# Altium schematic sheet LCDTFT_CTRL_FT811.SchDoc
size A3
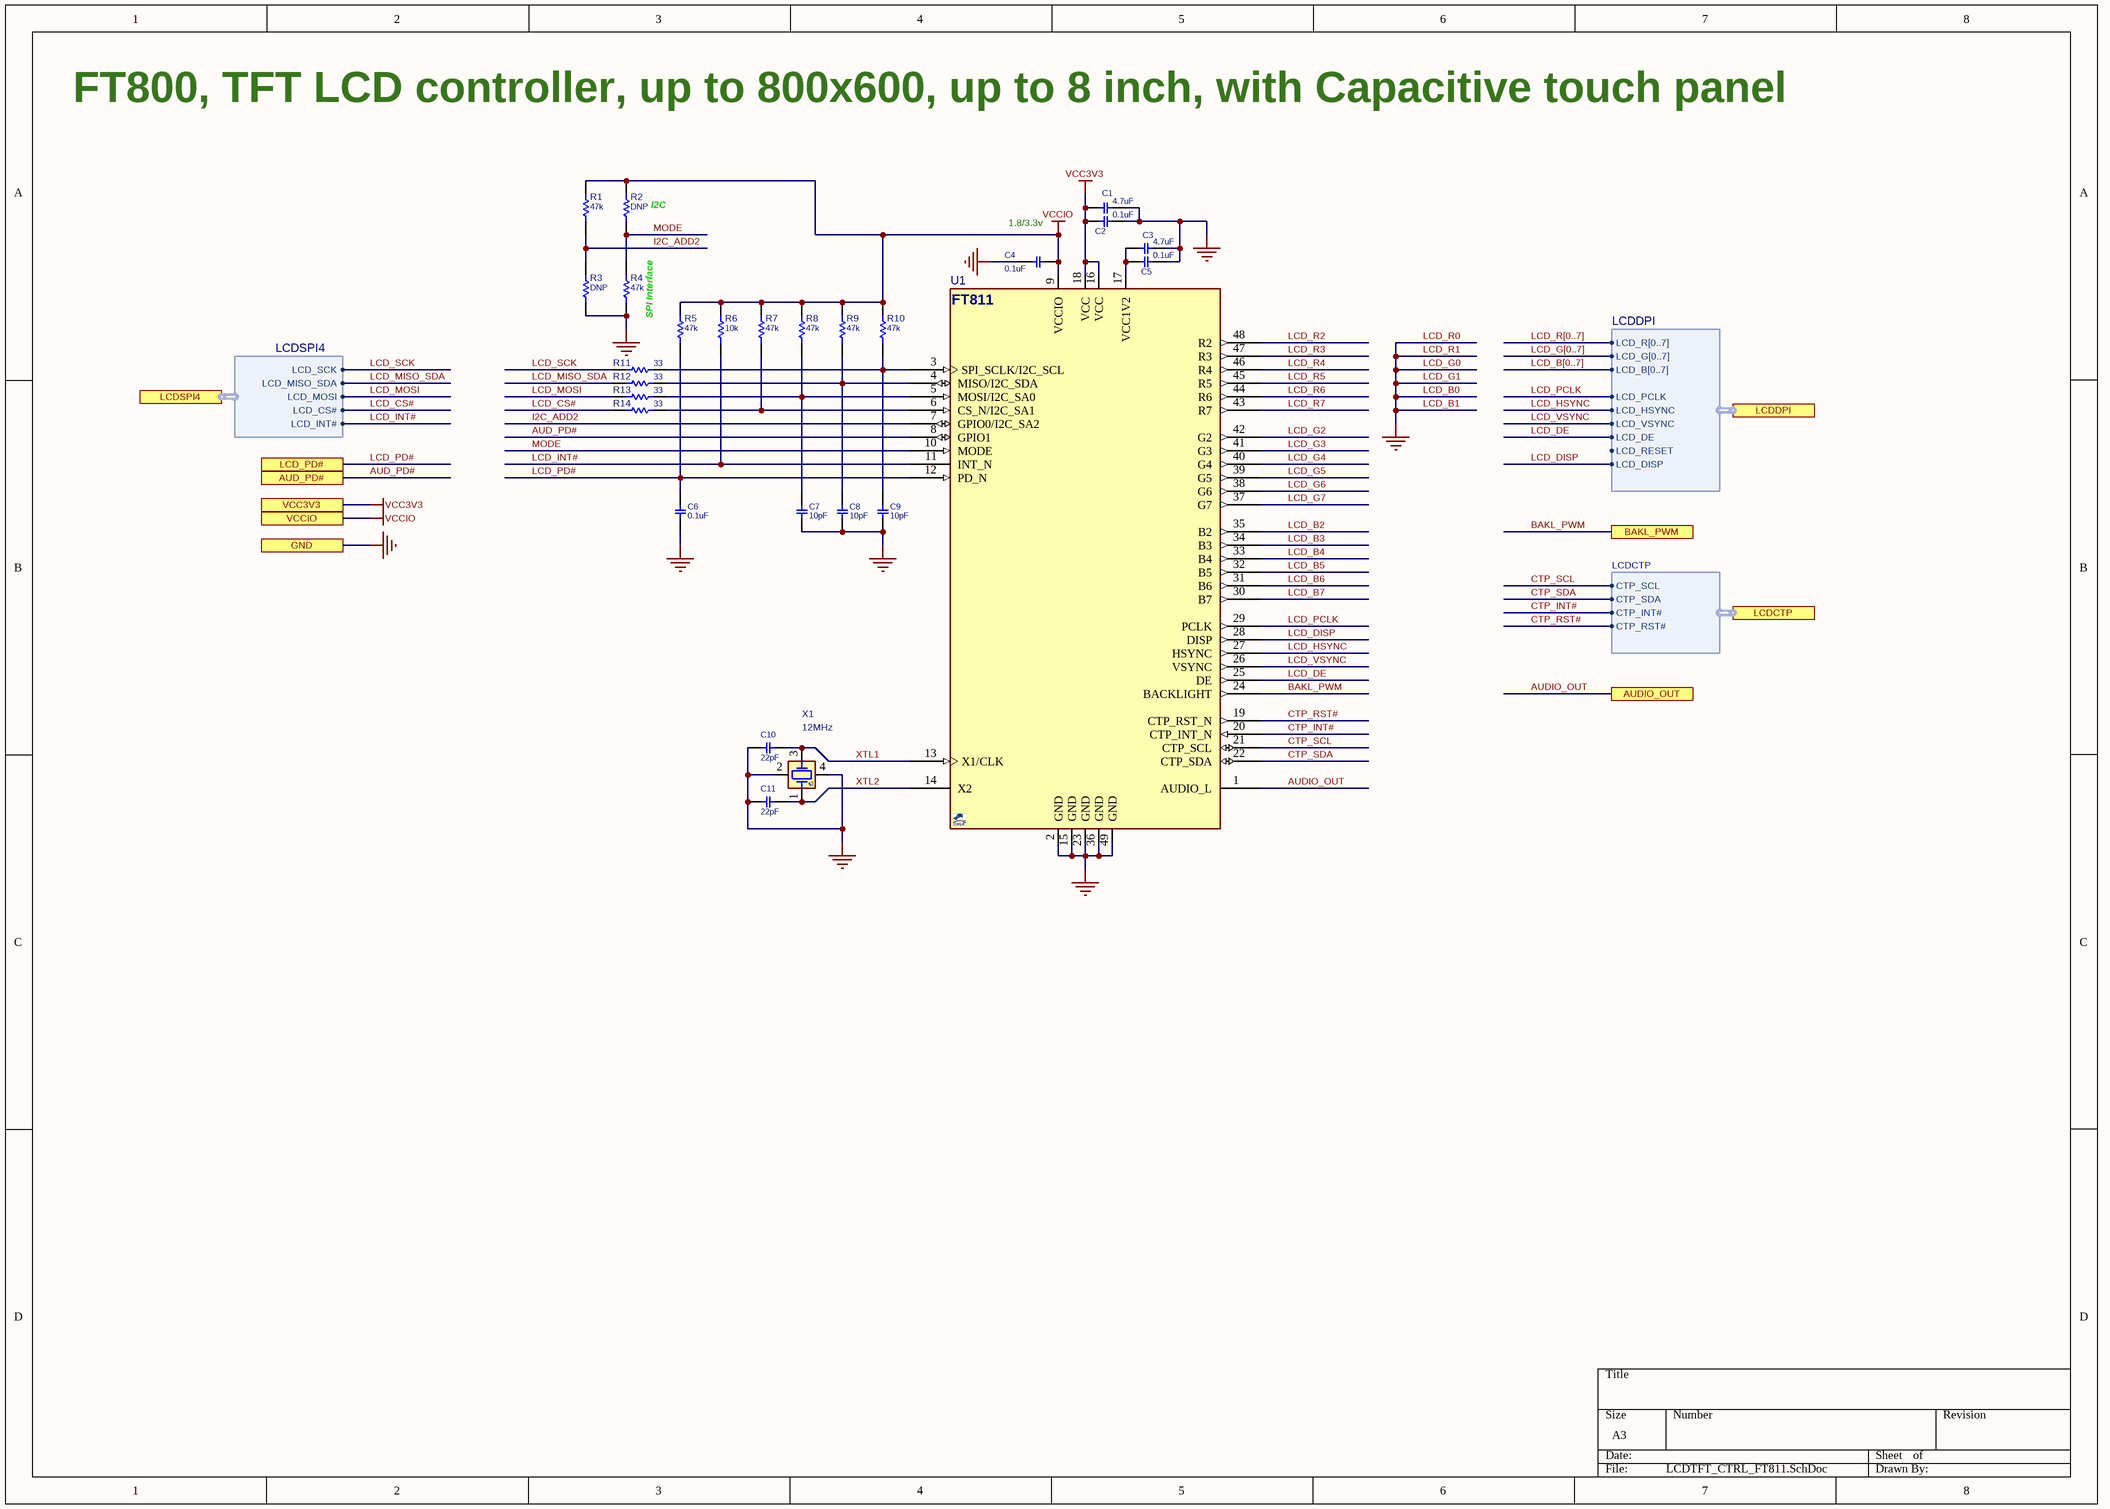
[diagram p0: LCDTFT_CTRL_FT811.SchDoc]

## Parts
C1  4.7uF  [C0603]
C2  0.1uF  [C0402]
C3  4.7uF  [C0603]
C4  0.1uF  [C0402]
C5  0.1uF  [C0402]
C6  0.1uF  [C0402]
C7  10pF  [C0402]
C8  10pF  [C0402]
C9  10pF  [C0402]
C10  22pF  [C0402]
C11  22pF  [C0402]
R1  47k  [R0402]
R2  DNP  [R0402]
R3  DNP  [R0402]
R4  47k  [R0402]
R5  47k  [R0402]
R6  10k  [R0402]
R7  47k  [R0402]
R8  47k  [R0402]
R9  47k  [R0402]
R10  47k  [R0402]
R11  33  [R0402]
R12  33  [R0402]
R13  33  [R0402]
R14  33  [R0402]
U1  FT811  [QFN50_48T]  (value not drawn)
X1  12MHz  [XTL_4_3225]

## Ports
AUD_PD#, AUDIO_OUT, BAKL_PWM, GND, LCD_PD#, LCDCTP (harness LCDCTP), LCDDPI (harness LCDDPI), LCDSPI4 (harness LCDSPI4), VCC3V3, VCCIO

## Harnesses
LCDDPI: LCD_PCLK, LCD_HSYNC, LCD_VSYNC, LCD_DE, LCD_R[0..7], LCD_G[0..7], LCD_B[0..7], LCD_RESET, LCD_DISP
LCDSPI4: LCD_SCK, LCD_MISO_SDA, LCD_MOSI, LCD_CS#, LCD_INT#
LCDCTP: CTP_SCL, CTP_SDA, CTP_INT#, CTP_RST#

## Nets
LCD_B0: C1.1 C2.1 C3.1 C4.2 C5.1 C6.2 C7.2 C8.2 C9.2 C10.1 C11.2 R3.2 R4.2 U1.2(GND) U1.15(GND) U1.23(GND) U1.36(GND) U1.49(GND) X1.2 X1.4 ; port GND  [also labelled GND, LCD_B1, LCD_G0, LCD_G1, LCD_R0, LCD_R1]
VCC3V3: C1.2 C2.2 U1.16(VCC) U1.18(VCC) ; port VCC3V3
VCCIO: C4.1 R1.1 R2.1 R5.1 R6.1 R7.1 R8.1 R9.1 R10.1 U1.9(VCCIO) ; port VCCIO
AUD_PD#: U1.8(GPIO1) ; port AUD_PD#
AUDIO_OUT: U1.1(AUDIO_L) ; port AUDIO_OUT
BAKL_PWM: U1.24(BACKLIGHT) ; port BAKL_PWM
CTP_INT#: U1.20(CTP_INT_N) ; port LCDCTP.CTP_INT#
CTP_RST#: U1.19(CTP_RST_N) ; port LCDCTP.CTP_RST#
CTP_SCL: U1.21(CTP_SCL) ; port LCDCTP.CTP_SCL
CTP_SDA: U1.22(CTP_SDA) ; port LCDCTP.CTP_SDA
I2C_ADD2: R1.2 R3.1 U1.7(GPIO0/I2C_SA2)
LCD_B2: U1.35(B2)
LCD_B3: U1.34(B3)
LCD_B4: U1.33(B4)
LCD_B5: U1.32(B5)
LCD_B6: U1.31(B6)
LCD_B7: U1.30(B7)
LCD_CS#: R14.1 ; port LCDSPI4.LCD_CS#
LCD_DE: U1.25(DE) ; port LCDDPI.LCD_DE
LCD_DISP: U1.28(DISP) ; port LCDDPI.LCD_DISP
LCD_G2: U1.42(G2)
LCD_G3: U1.41(G3)
LCD_G4: U1.40(G4)
LCD_G5: U1.39(G5)
LCD_G6: U1.38(G6)
LCD_G7: U1.37(G7)
LCD_HSYNC: U1.27(HSYNC) ; port LCDDPI.LCD_HSYNC
LCD_INT#: R6.2 U1.11(INT_N) ; port LCDSPI4.LCD_INT#
LCD_MISO_SDA: R12.1 ; port LCDSPI4.LCD_MISO_SDA
LCD_MOSI: R13.1 ; port LCDSPI4.LCD_MOSI
LCD_PCLK: U1.29(PCLK) ; port LCDDPI.LCD_PCLK
LCD_PD#: C6.1 R5.2 U1.12(PD_N) ; port LCD_PD#
LCD_R2: U1.48(R2)
LCD_R3: U1.47(R3)
LCD_R4: U1.46(R4)
LCD_R5: U1.45(R5)
LCD_R6: U1.44(R6)
LCD_R7: U1.43(R7)
LCD_SCK: R11.1 ; port LCDSPI4.LCD_SCK
LCD_VSYNC: U1.26(VSYNC) ; port LCDDPI.LCD_VSYNC
MODE: R2.2 R4.1 U1.10(MODE)
XTL1: C10.2 U1.13(X1/CLK) X1.3
XTL2: C11.1 U1.14(X2) X1.1
NetC3_2: C3.2 C5.2 U1.17(VCC1V2)
NetC7_1: C7.1 R8.2 R13.2 U1.5(MOSI/I2C_SA0)
NetC8_1: C8.1 R9.2 R12.2 U1.4(MISO/I2C_SDA)
NetC9_1: C9.1 R10.2 R11.2 U1.3(SPI_SCLK/I2C_SCL)
NetR7_2: R7.2 R14.2 U1.6(CS_N/I2C_SA1)

## Buses and harness runs
bus LCD_B[0..7]
bus LCD_G[0..7]
bus LCD_R[0..7]

## Notes on the sheet
- FT800, TFT LCD controller, up to 800x600, up to 8 inch, with Capacitive touch panel
- (near R2) I2C
- 1.8/3.3v
- SPI Interface

## Library data of the parts
C1 C3 = CAP_SMD_MLCC: CAP, MLCC; PARAM: X5R, 10%; PRICE: 50,000:	$0.006; MANF_P#: -; MANF: -; PARAM2: -; ASSEMBLY: ASSEMBLY; VALUE: 4.7uF
C2 C4-C6 = CAP_SMD_MLCC: CAP, MLCC; PARAM: X7R, 10%, -55~125oC; MANF_P#: GRM155R71H104KE14D; MANF: Murata; PARAM2: 50v; PRICE: 100: 0.018$; ASSEMBLY: ASSEMBLY; VALUE: 0.1uF
C7-C11 = CAP_SMD_MLCC: CAP, MLCC; PARAM2: 50v; PARAM: -; PRICE: 100: 0.018$; MANF_P#: -; MANF: -; ASSEMBLY: ASSEMBLY
  C7-C9: VALUE: 10pF
  C10 C11: VALUE: 22pF
R1-R14 = RES_SMD: RESISTOR, SMD; PARAM: 0.063W; DESC: DESCRIPTION; DIST#: MOUSER; PARAM2: 1%; MANF_P#: -; MANF: -; ASSEMBLY: ASSEMBLY; PRICE: 100= 0.3$
  R1 R4 R5 R7-R10: VALUE: 47k
  R2 R3: VALUE: DNP
  R6: VALUE: 10k
  R11-R14: VALUE: 33
U1 = FT811_QFN48: LCD Display Controller, Embedded Video Engine, QFN-48; MANF: FTDI/Bridgetek; MANF_P#: FT811Q; PARAM2: 1.8~3.3Vcc; PARAM: -40~85°C; PRICE: 5$; VALUE: FT811
X1 = XTL_4_12MHz_3225: Crystal 12MHz; MANF: ECS; MANF_P#: ECS-120-18-33-JEM-TR; PARAM: 20PPM, 18pF; PRICE: 0.5$; VALUE: 12MHz